# Altium schematic sheet CM_CLK.SchDoc
size Tabloid; SheetNumber: 8; SheetTotal: 14; Size: 11x17; Sheet_Name: CM_CLK
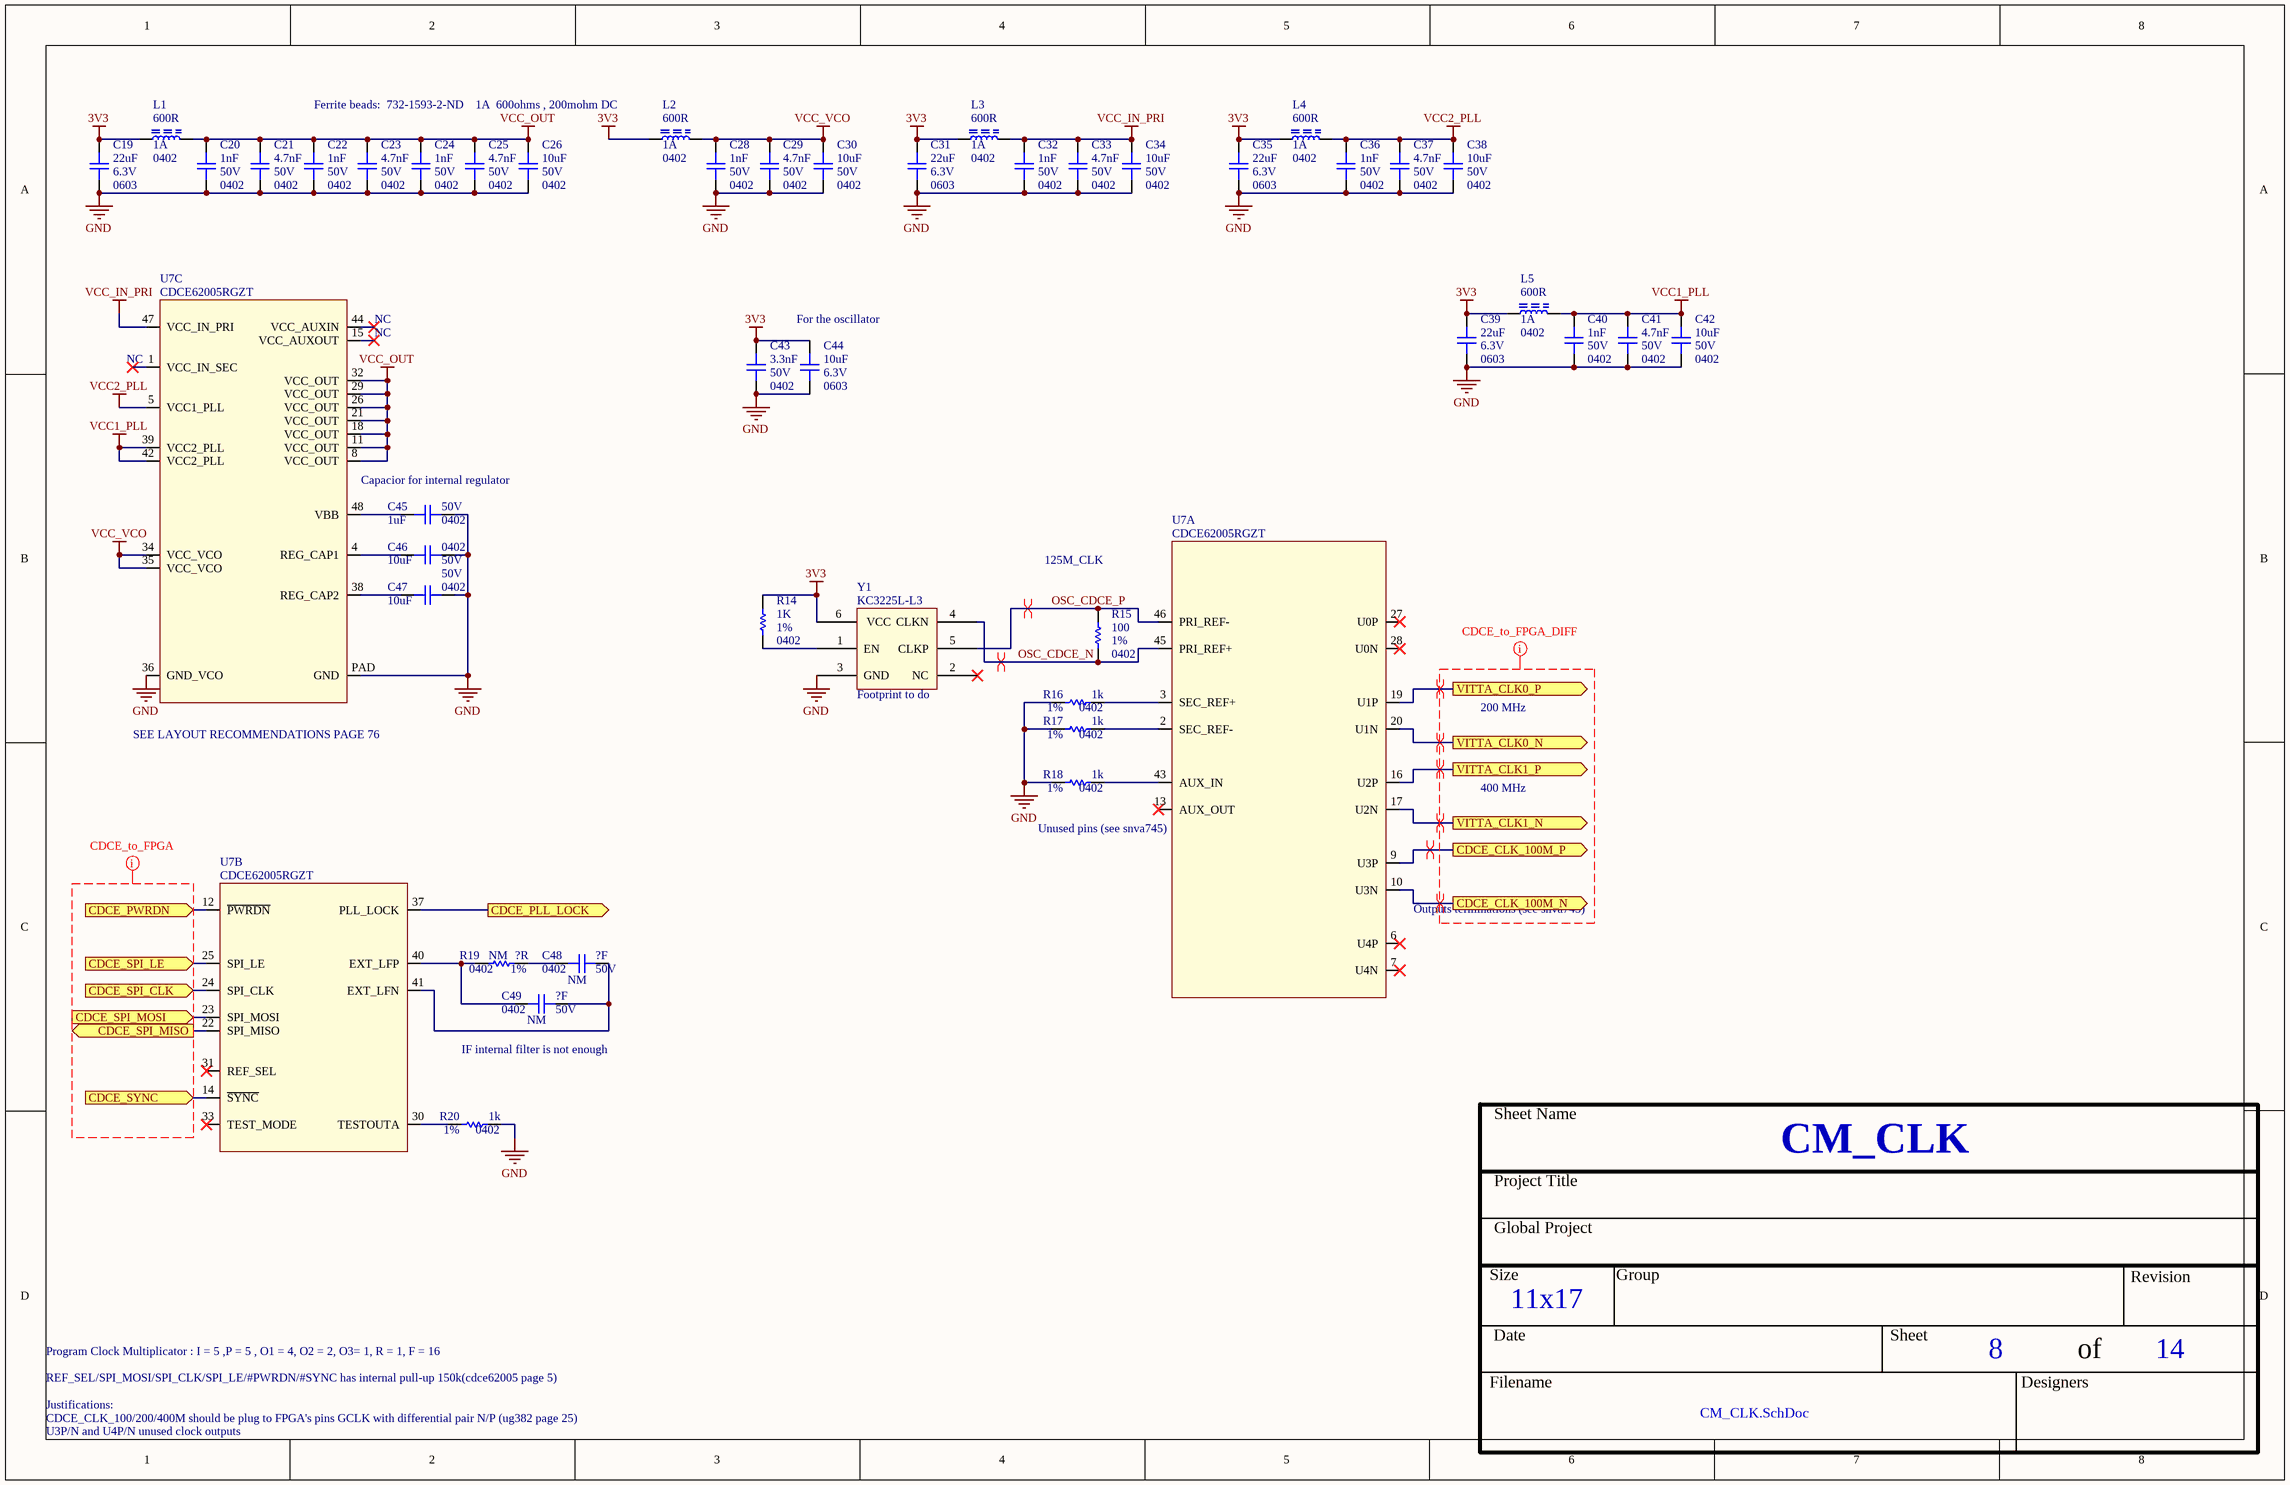
[diagram p0: CM_CLK.SchDoc]

## Parts
C19  value 22uF  Voltage: 6.3V  Package: 0603  [CAP_0603]  (hidden comment: CAP - 0603)
C20  value 1nF  Voltage: 50V  Package: 0402  [CAP_0402]  (hidden comment: CAP - 0402)
C21  value 4.7nF  Voltage: 50V  Package: 0402  [CAP_0402]  (hidden comment: CAP - 0402)
C22  value 1nF  Voltage: 50V  Package: 0402  [CAP_0402]  (hidden comment: CAP - 0402)
C23  value 4.7nF  Voltage: 50V  Package: 0402  [CAP_0402]  (hidden comment: CAP - 0402)
C24  value 1nF  Voltage: 50V  Package: 0402  [CAP_0402]  (hidden comment: CAP - 0402)
C25  value 4.7nF  Voltage: 50V  Package: 0402  [CAP_0402]  (hidden comment: CAP - 0402)
C26  value 10uF  Voltage: 50V  Package: 0402  [CAP_0402]  (hidden comment: CAP - 0402)
C28  value 1nF  Voltage: 50V  Package: 0402  [CAP_0402]  (hidden comment: CAP - 0402)
C29  value 4.7nF  Voltage: 50V  Package: 0402  [CAP_0402]  (hidden comment: CAP - 0402)
C30  value 10uF  Voltage: 50V  Package: 0402  [CAP_0402]  (hidden comment: CAP - 0402)
C31  value 22uF  Voltage: 6.3V  Package: 0603  [CAP_0603]  (hidden comment: CAP - 0603)
C32  value 1nF  Voltage: 50V  Package: 0402  [CAP_0402]  (hidden comment: CAP - 0402)
C33  value 4.7nF  Voltage: 50V  Package: 0402  [CAP_0402]  (hidden comment: CAP - 0402)
C34  value 10uF  Voltage: 50V  Package: 0402  [CAP_0402]  (hidden comment: CAP - 0402)
C35  value 22uF  Voltage: 6.3V  Package: 0603  [CAP_0603]  (hidden comment: CAP - 0603)
C36  value 1nF  Voltage: 50V  Package: 0402  [CAP_0402]  (hidden comment: CAP - 0402)
C37  value 4.7nF  Voltage: 50V  Package: 0402  [CAP_0402]  (hidden comment: CAP - 0402)
C38  value 10uF  Voltage: 50V  Package: 0402  [CAP_0402]  (hidden comment: CAP - 0402)
C39  value 22uF  Voltage: 6.3V  Package: 0603  [CAP_0603]  (hidden comment: CAP - 0603)
C40  value 1nF  Voltage: 50V  Package: 0402  [CAP_0402]  (hidden comment: CAP - 0402)
C41  value 4.7nF  Voltage: 50V  Package: 0402  [CAP_0402]  (hidden comment: CAP - 0402)
C42  value 10uF  Voltage: 50V  Package: 0402  [CAP_0402]  (hidden comment: CAP - 0402)
C43  value 3.3nF  Voltage: 50V  Package: 0402  [CAP_0402]  (hidden comment: CAP - 0402)
C44  value 10uF  Voltage: 6.3V  Package: 0603  [CAP_0603]  (hidden comment: CAP - 0603)
C45  value 1uF  Voltage: 50V  Package: 0402  [CAP_0402]  (hidden comment: CAP - 0402)
C46  value 10uF  Voltage: 50V  Package: 0402  [CAP_0402]  (hidden comment: CAP - 0402)
C47  value 10uF  Voltage: 50V  Package: 0402  [CAP_0402]  (hidden comment: CAP - 0402)
C48  NM  value ?F  Voltage: 50V  Package: 0402  [CAP_0402]
C49  NM  value ?F  Voltage: 50V  Package: 0402  [CAP_0402]
L1  value 600R  Current: 1A  Package: 0402  [FER_0402]  (hidden comment: FER - 0402)
L2  value 600R  Current: 1A  Package: 0402  [FER_0402]  (hidden comment: FER - 0402)
L3  value 600R  Current: 1A  Package: 0402  [FER_0402]  (hidden comment: FER - 0402)
L4  value 600R  Current: 1A  Package: 0402  [FER_0402]  (hidden comment: FER - 0402)
L5  value 600R  Current: 1A  Package: 0402  [FER_0402]  (hidden comment: FER - 0402)
R14  value 1K  Package: 0402  Precision: 1%  [RES_0402]  (hidden comment: RES - 0402)
R15  value 100  Package: 0402  Precision: 1%  [RES_0402]  (hidden comment: RES - 0402)
R16  value 1k  Package: 0402  Precision: 1%  [RES_0402]  (hidden comment: RES - 0402)
R17  value 1k  Package: 0402  Precision: 1%  [RES_0402]  (hidden comment: RES - 0402)
R18  value 1k  Package: 0402  Precision: 1%  [RES_0402]  (hidden comment: RES - 0402)
R19  NM  value ?R  Package: 0402  Precision: 1%  [RES_0402]
R20  value 1k  Package: 0402  Precision: 1%  [RES_0402]  (hidden comment: RES - 0402)
U7  CDCE62005RGZT  [TIM_CDCE62005RGZT]  (parts A,B,C of 3)
Y1  KC3225L-L3  [KC3225L-L3]

## Ports
CDCE_CLK_100M_N (out), CDCE_CLK_100M_P (out), CDCE_PLL_LOCK (out), CDCE_PWRDN (in), CDCE_SPI_CLK (in), CDCE_SPI_LE (in), CDCE_SPI_MISO (out), CDCE_SPI_MOSI (in), CDCE_SYNC (in), VITTA_CLK0_N (out), VITTA_CLK0_P (out), VITTA_CLK1_N (out), VITTA_CLK1_P (out)

## Nets
3V3: C19.2 C31.2 C35.2 C39.2 C43.2 C44.2 L1.2 L2.2 L3.2 L4.2 L5.2 R14.1 Y1.6(VCC)
GND: C19.1 C20.1 C21.1 C22.1 C23.1 C24.1 C25.1 C26.1 C28.1 C29.1 C30.1 C31.1 C32.1 C33.1 C34.1 C35.1 C36.1 C37.1 C38.1 C39.1 C40.1 C41.1 C42.1 C43.1 C44.1 C45.1 C46.1 C47.1 R16.2 R17.2 R18.2 R20.1 U7.36(GND_VCO) U7.PAD(GND) Y1.3(GND)
VCC1_PLL: C40.2 C41.2 C42.2 L5.1 U7.39(VCC2_PLL) U7.42(VCC2_PLL)
VCC2_PLL: C36.2 C37.2 C38.2 L4.1 U7.5(VCC1_PLL)
VCC_IN_PRI: C32.2 C33.2 C34.2 L3.1 U7.47(VCC_IN_PRI)
VCC_OUT: C20.2 C21.2 C22.2 C23.2 C24.2 C25.2 C26.2 L1.1 U7.8(VCC_OUT) U7.11(VCC_OUT) U7.18(VCC_OUT) U7.21(VCC_OUT) U7.26(VCC_OUT) U7.29(VCC_OUT) U7.32(VCC_OUT)
VCC_VCO: C28.2 C29.2 C30.2 L2.1 U7.34(VCC_VCO) U7.35(VCC_VCO)
CDCE_CLK_100M_N: U7.10(U3N) ; port CDCE_CLK_100M_N
CDCE_CLK_100M_P: U7.9(U3P) ; port CDCE_CLK_100M_P
CDCE_PLL_LOCK: U7.37(PLL_LOCK) ; port CDCE_PLL_LOCK
CDCE_PWRDN: U7.12(~{PWRDN}) ; port CDCE_PWRDN
CDCE_SPI_CLK: U7.24(SPI_CLK) ; port CDCE_SPI_CLK
CDCE_SPI_LE: U7.25(SPI_LE) ; port CDCE_SPI_LE
CDCE_SPI_MISO: U7.22(SPI_MISO) ; port CDCE_SPI_MISO
CDCE_SPI_MOSI: U7.23(SPI_MOSI) ; port CDCE_SPI_MOSI
CDCE_SYNC: U7.14(~{SYNC}) ; port CDCE_SYNC
OSC_CDCE_N: R15.2 U7.45(PRI_REF+) Y1.4(CLKN)
OSC_CDCE_P: R15.1 U7.46(PRI_REF-) Y1.5(CLKP)
VITTA_CLK0_N: U7.20(U1N) ; port VITTA_CLK0_N
VITTA_CLK0_P: U7.19(U1P) ; port VITTA_CLK0_P
VITTA_CLK1_N: U7.17(U2N) ; port VITTA_CLK1_N
VITTA_CLK1_P: U7.16(U2P) ; port VITTA_CLK1_P
NetC45_2: C45.2 U7.48(VBB)
NetC46_2: C46.2 U7.4(REG_CAP1)
NetC47_2: C47.2 U7.38(REG_CAP2)
NetC48_1: C48.1 C49.1 U7.41(EXT_LFN)
NetC48_2: C48.2 R19.1
NetC49_2: C49.2 R19.2 U7.40(EXT_LFP)
NetR14_2: R14.2 Y1.1(EN)
NetR16_1: R16.1 U7.3(SEC_REF+)
NetR17_1: R17.1 U7.2(SEC_REF-)
NetR18_1: R18.1 U7.43(AUX_IN)
NetR20_2: R20.2 U7.30(TESTOUTA)

Not connected (* = marked no-connect by the designer): U7 1(VCC_IN_SEC)* 6(U4P)* 7(U4N)* 13(AUX_OUT)* 15(VCC_AUXOUT)* 27(U0P)* 28(U0N)* 31(REF_SEL)* 33(TEST_MODE)* 44(VCC_AUXIN)*; Y1 2(NC)*

## Layout directives
differential pair: CDCE_CLK_100M_N, CDCE_CLK_100M_P, OSC_CDCE_N, OSC_CDCE_P, VITTA_CLK0_N, VITTA_CLK0_P, VITTA_CLK1_N, VITTA_CLK1_P
net class CDCE_to_FPGA: (no net found under the mark)
net class CDCE_to_FPGA_DIFF: (no net found under the mark)

## Notes on the sheet
- Ferrite beads:  732-1593-2-ND    1A  600ohms , 200mohm DC
- (near U7) NC
- (near C44) For the oscillator
- (near U7) Capacior for internal regulator
- 125M_CLK
- (near Y1) Footprint to do
- SEE LAYOUT RECOMMENDATIONS PAGE 76
- 200 MHz
- (near U7) Unused pins (see snva745)
- 400 MHz
- (near U7) Outputs terminations (see snva745)
- IF internal filter is not enough
- Program Clock Multiplicator : I = 5 ,P = 5 , O1 = 4, O2 = 2, O3= 1, R = 1, F = 16
- CDCE_CLK_100/200/400M should be plug to FPGA's pins GCLK with differential pair N/P (ug382 page 25)
- U3P/N and U4P/N unused clock outputs
- Justifications:
- REF_SEL/SPI_MOSI/SPI_CLK/SPI_LE/#PWRDN/#SYNC has internal pull-up 150k(cdce62005 page 5)
- Sheet Name
- Project Title
- Global Project
- Size
- Group
- Revision
- Date
- Sheet
- of
- Filename
- Designers

## Library data of the parts
C19 C31 C35 C39 C44 = CAP - 0603: Precision: 10%; Current: *; CreatedBy: Jonathan Bouchard; Power: *
C20-C26 C28-C30 C32-C34 C36-C38 C40-C43 C45-C49 = CAP - 0402: Precision: 10%; Current: *; CreatedBy: Jonathan Bouchard; Power: *
R14-R20 = RES - 0402: Voltage: 50V; Power: 1/16W; Current: *; CreatedBy: Jonathan Bouchard
U7 = TIM_CDCE62005RGZT: TIM - CLK SYNTH JITTER CLEANER 3:5 - QFN-48; Voltage: 3 V ~ 3.6 V; Mfg: Texas Instruments; Current: *; Power: *; Mfg Part Number: CDCE62005RGZT; HelpURL: http://www.ti.com/lit/ds/symlink/cdce62005.pdf; CreatedBy: Jonathan Bouchard; Temperature: -40°C ~ 85°C; Value: *; Precision: *; Package: QFN-48; Supplier 1: Digikey; Supplier Part Number 1: 296-23947-1-ND
L1-L5 = FER - 0402: Voltage: *; CreatedBy: Jonathan Bouchard; Power: *; Precision: *
Y1 = KC3225L-L3: datasheet: https://www.mouser.ca/datasheet/2/909/kc3225l_l2l3_e-1368039.pdf